# Altium schematic sheet BaseSheet.SchDoc: UnoCNC
size A3; PageSetup: Record=PageOptions|CenterHorizontal=True|CenterVertical=True|PrintScale=0.73|XCorrection=1.00|YCorrection=1.00|PrintKind=1|BorderSize=5000000|LeftOffset=0|BottomOffset=0|Orientation=2|PaperLength=1000|PaperWidth=1000|Scale=100|PaperSource=7|PrintQuality=-3|MediaType=1|DitherType=10|PrintScaleMode=1|PaperKind=A4|PaperIndex=9
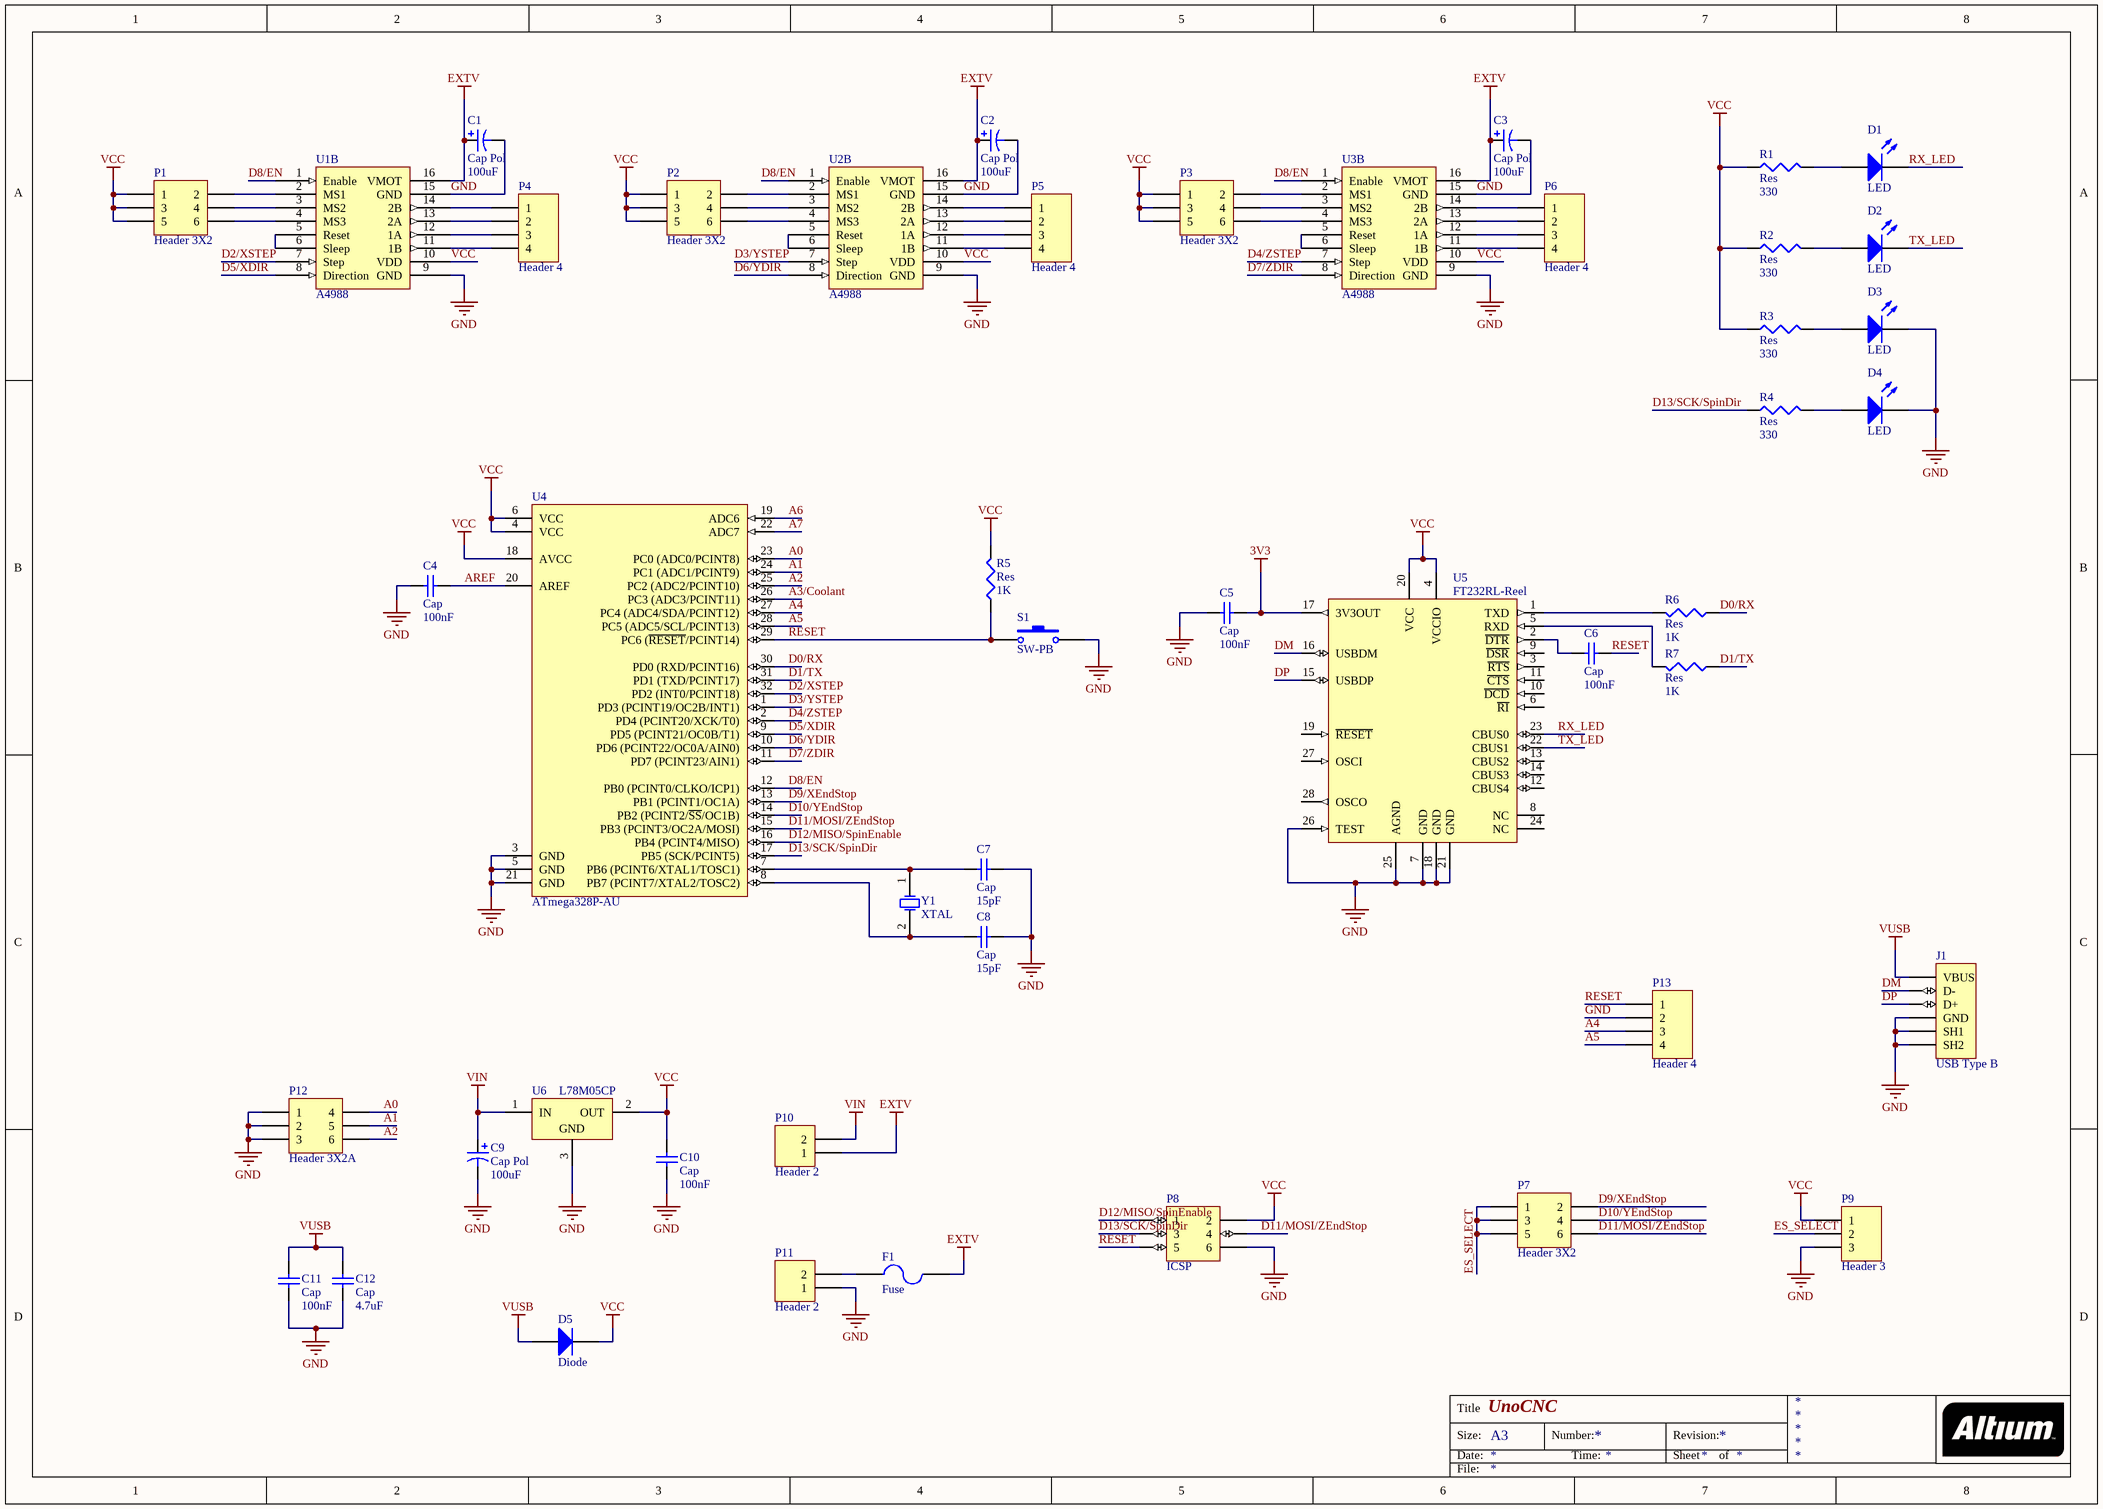
[diagram p0: BaseSheet.SchDoc]

## Parts
C1  Cap Pol  value 100uF  [CAPPR2.5-6.3x6.8/H.9]
C2  Cap Pol  value 100uF  [CAPPR2.5-6.3x6.8/H.9]
C3  Cap Pol  value 100uF  [CAPPR2.5-6.3x6.8/H.9]
C4  Cap  value 100nF  [C1206]
C5  Cap  value 100nF  [C1206]
C6  Cap  value 100nF  [C1206]
C7  Cap  value 15pF  [C1206]
C8  Cap  value 15pF  [C1206]
C9  Cap Pol  value 100uF  [CAPPR2.5-6.3x6.8/H.9]
C10  Cap  value 100nF  [C1206]
C11  Cap  value 100nF  [C1206]
C12  Cap  value 4.7uF  [C1206]
D1  LED  [6-0805_L]
D2  LED  [6-0805_L]
D3  LED  [6-0805_L]
D4  LED  [6-0805_L]
D5  Diode  [DSO-C2/X2.3]
F1  Fuse  [BLX-A]
J1  USB Type B  [USB2.5-2H4D]
P1  Header 3X2  [HDR2X3]
P2  Header 3X2  [HDR2X3]
P3  Header 3X2  [HDR2X3]
P4  Header 4  [HDR1X4]
P5  Header 4  [HDR1X4]
P6  Header 4  [HDR1X4]
P7  Header 3X2  [HDR2X3]
P8  ICSP  [HDR2X3]
P9  Header 3  [HDR1X3]
P10  Header 2  [HDR1X2]
P11  Header 2  [2Pin Phoenix Contact]
P12  Header 3X2A  [HDR2X3_CEN]
P13  Header 4  [HDR1X4]
R1  Res  value 330  [J1-0603]
R2  Res  value 330  [J1-0603]
R3  Res  value 330  [J1-0603]
R4  Res  value 330  [J1-0603]
R5  Res  value 1K  [J1-0603]
R6  Res  value 1K  [J1-0603]
R7  Res  value 1K  [J1-0603]
S1  SW-PB  [SPST-2]
U1  A4988  [DIP16]  (part B of 2)
U2  A4988  [DIP16]  (part B of 2)
U3  A4988  [DIP16]  (part B of 2)
U4  ATmega328P-AU  [32A_N]
U5  FT232RL-Reel  [SSOP-28_N]
U6  L78M05CP  [ISOWATT220AB]
Y1  XTAL  [BCY-W2/E4.7]

## Nets
3V3: C5.2 U5.17(3V3OUT)
EXTV: C1.1 C2.1 C3.1 F1.2 P10.1 U1.16(VMOT) U2.16(VMOT) U3.16(VMOT)
GND: C1.2 C2.2 C3.2 C4.1 C5.1 C7.2 C8.2 C9.2 C10.1 C11.1 C12.1 D3.2(K) D4.2(K) J1.4(GND) J1.5(SH1) J1.6(SH2) P8.6 P9.3 P11.1 P12.1 P12.2 P12.3 P13.2 S1.2 U1.9(GND) U1.15(GND) U2.9(GND) U2.15(GND) U3.9(GND) U3.15(GND) U4.3(GND) U4.5(GND) U4.21(GND) U5.7(GND) U5.18(GND) U5.21(GND) U5.25(AGND) U5.26(TEST) U6.3(GND)
VCC: C10.2 D5.2(K) P1.1 P1.3 P1.5 P2.1 P2.3 P2.5 P3.1 P3.3 P3.5 P8.2 P9.1 R1.1 R2.1 R3.1 R5.2 U1.10(VDD) U2.10(VDD) U3.10(VDD) U4.4(VCC) U4.6(VCC) U4.18(AVCC) U5.4(VCCIO) U5.20(VCC) U6.2(OUT)
VIN: C9.1 P10.2 U6.1(IN)
VUSB: C11.2 C12.2 D5.1(A) J1.1(VBUS)
A0: P12.4 U4.23(PC0_(ADC0/PCINT8))
A1: P12.5 U4.24(PC1_(ADC1/PCINT9))
A2: P12.6 U4.25(PC2_(ADC2/PCINT10))
A3/Coolant: U4.26(PC3_(ADC3/PCINT11))
A4: P13.3 U4.27(PC4_(ADC4/SDA/PCINT12))
A5: P13.4 U4.28(PC5_(ADC5/SCL/PCINT13))
A6: U4.19(ADC6)
A7: U4.22(ADC7)
AREF: C4.2 U4.20(AREF)
D0/RX: R6.1 U4.30(PD0_(RXD/PCINT16))
D1/TX: R7.1 U4.31(PD1_(TXD/PCINT17))
D2/XSTEP: U1.7(Step) U4.32(PD2_(INT0/PCINT18))
D3/YSTEP: U2.7(Step) U4.1(PD3_(PCINT19/OC2B/INT1))
D4/ZSTEP: U3.7(Step) U4.2(PD4_(PCINT20/XCK/T0))
D5/XDIR: U1.8(Direction) U4.9(PD5_(PCINT21/OC0B/T1))
D6/YDIR: U2.8(Direction) U4.10(PD6_(PCINT22/OC0A/AIN0))
D7/ZDIR: U3.8(Direction) U4.11(PD7_(PCINT23/AIN1))
D8/EN: U1.1(Enable) U2.1(Enable) U3.1(Enable) U4.12(PB0_(PCINT0/CLKO/ICP1))
D9/XEndStop: P7.2 U4.13(PB1_(PCINT1/OC1A))
D10/YEndStop: P7.4 U4.14(PB2_(PCINT2/~{SS}/OC1B))
D11/MOSI/ZEndStop: P7.6 P8.4 U4.15(PB3_(PCINT3/OC2A/MOSI))
D12/MISO/SpinEnable: P8.1 U4.16(PB4_(PCINT4/MISO))
D13/SCK/SpinDir: P8.3 R4.1 U4.17(PB5_(SCK/PCINT5))
DM: J1.2(D-) U5.16(USBDM)
DP: J1.3(D+) U5.15(USBDP)
ES_SELECT: P7.1 P7.3 P7.5 P9.2
RESET: C6.2 P8.5 P13.1 R5.1 S1.1 U4.29(PC6_(~{RESET}/PCINT14))
RX_LED: D1.2(K) U5.23(CBUS0)
TX_LED: D2.2(K) U5.22(CBUS1)
NetC6_1: C6.1 U5.2(~{DTR})
NetC7_1: C7.1 U4.7(PB6_(PCINT6/XTAL1/TOSC1)) Y1.1(OSC1)
NetC8_1: C8.1 U4.8(PB7_(PCINT7/XTAL2/TOSC2)) Y1.2(OSC2)
NetD1_1: D1.1(A) R1.2
NetD2_1: D2.1(A) R2.2
NetD3_1: D3.1(A) R3.2
NetD4_1: D4.1(A) R4.2
NetF1_1: F1.1 P11.2
NetP1_2: P1.2 U1.2(MS1)
NetP1_4: P1.4 U1.3(MS2)
NetP1_6: P1.6 U1.4(MS3)
NetP2_2: P2.2 U2.2(MS1)
NetP2_4: P2.4 U2.3(MS2)
NetP2_6: P2.6 U2.4(MS3)
NetP3_2: P3.2 U3.2(MS1)
NetP3_4: P3.4 U3.3(MS2)
NetP3_6: P3.6 U3.4(MS3)
NetP4_1: P4.1 U1.14(2B)
NetP4_2: P4.2 U1.13(2A)
NetP4_3: P4.3 U1.12(1A)
NetP4_4: P4.4 U1.11(1B)
NetP5_1: P5.1 U2.14(2B)
NetP5_2: P5.2 U2.13(2A)
NetP5_3: P5.3 U2.12(1A)
NetP5_4: P5.4 U2.11(1B)
NetP6_1: P6.1 U3.14(2B)
NetP6_2: P6.2 U3.13(2A)
NetP6_3: P6.3 U3.12(1A)
NetP6_4: P6.4 U3.11(1B)
NetR6_2: R6.2 U5.1(TXD)
NetR7_2: R7.2 U5.5(RXD)
NetU1_5: U1.5(Reset) U1.6(Sleep)
NetU2_5: U2.5(Reset) U2.6(Sleep)
NetU3_5: U3.5(Reset) U3.6(Sleep)

Not connected (* = marked no-connect by the designer): U5 3(~{RTS}) 6(~{RI}) 8(NC) 9(~{DSR}) 10(~{DCD}) 11(~{CTS}) 12(CBUS4) 13(CBUS2) 14(CBUS3) 19(~{RESET}) 24(NC) 27(OSCI) 28(OSCO)

## Notes on the sheet
- Title
- Size:
- Date:
- A3
- Number:
- Time:
- Revision:
- Sheet
- of
- File:

## Library data of the parts
C1-C3 C9 = Cap Pol1: Polarized Capacitor (Radial); Published: 8-Jun-2000; LatestRevisionDate: 17-Jul-2002; LatestRevisionNote: Re-released for DXP Platform.; PackageReference: RB7.6-15; Publisher: Altium Limited; PackageDescription: Polarized Capacitor (Radial); 2 Leads
C4-C8 C10-C12 = Cap Semi: Capacitor (Semiconductor SIM Model); Published: 8-Jun-2000; LatestRevisionDate: 29-May-2009; LatestRevisionNote: IPC-7351 Footprint Added.; PackageReference: C1206; Publisher: Altium Limited; PackageDescription: Chip Capacitor
D1-D4 = LED3: Typical BLUE SiC LED; Published: 8-Jun-2000; LatestRevisionDate: 17-Dec-2003; LatestRevisionNote: PCB Footprint replaced.; DatasheetVersion: 16-Apr-2002; PackageVersion: 16-Apr-2002; PackageReference: 3.5X2.8X1.9; Publisher: Altium Limited; PackageDescription: SM LED; 2 C-Bend Leads; Body 3.5 x 2.8 x 1.9 mm, inc leads (LxWxH typ)
D5 = Diode: Default Diode; Published: 8-Jun-2000; LatestRevisionDate: 17-Jul-2002; LatestRevisionNote: Re-released for DXP Platform.; PackageVersion: Sep-1996; PackageReference: SMC; Publisher: Altium Limited; PackageDescription: DO-214-AB/SMC; 2 C-Bend Leads; Body 7.9 x 5.9 mm, inc. leads (LxW); Code_JEDEC: DO-214-AB
F1 = Fuse 2: Published: 8-Jun-2000; LatestRevisionDate: 17-Jul-2002; LatestRevisionNote: Re-released for DXP Platform.; PackageReference: PIN-W2/E2.8; Publisher: Altium Limited; PackageDescription: Thru-Hole; 2 Leads
J1 = Header 6: Header, 6-Pin; LatestRevisionDate: 17-Jul-2002; LatestRevisionNote: Re-released for DXP Platform.; Publisher: Altium Limited
P1-P3 P7 P8 = Header 3X2: Header, 3-Pin, Dual row; LatestRevisionDate: 17-Jul-2002; LatestRevisionNote: Re-released for DXP Platform.; Publisher: Altium Limited
P4-P6 P13 = Header 4: Header, 4-Pin; LatestRevisionDate: 17-Jul-2002; LatestRevisionNote: Re-released for DXP Platform.; Publisher: Altium Limited
P9 = Header 3: Header, 3-Pin; LatestRevisionDate: 17-Jul-2002; LatestRevisionNote: Re-released for DXP Platform.; Publisher: Altium Limited
P10 P11 = Header 2: Header, 2-Pin; LatestRevisionDate: 17-Jul-2002; LatestRevisionNote: Re-released for DXP Platform.; Publisher: Altium Limited
P12 = Header 3X2A: Header, 3-Pin, Dual row; LatestRevisionDate: 17-Jul-2002; LatestRevisionNote: Re-released for DXP Platform.; Publisher: Altium Limited
R1-R7 = Res3: Resistor; Published: 8-Jun-2000; LatestRevisionDate: 29-May-2009; LatestRevisionNote: IPC-7351 Footprint Added.; PackageReference: J1-0603; Publisher: Altium Limited; PackageDescription: Chip Resistor
S1 = SW-PB: Switch; Published: 24-Mar-1999; LatestRevisionDate: 17-Jul-2002; LatestRevisionNote: Re-released for DXP Platform.; PackageReference: SPST-2; Publisher: Altium Limited; PackageDescription: Switch; 2 Leads
U1-U3 = A4988: Stepper Motor Driver
U4 = ATmega328P-AU: 8-bit AVR Microcontroller, 32KB Flash, 1KB EEPROM, 2KB SRAM, 32-pin TQFP, Industrial Grade (-40°C to 85°C); Published: 1-Apr-2010; DatasheetVersion: revA, Jan-2010; PackageVersion: revB, Oct-2001; PackageReference: 32A; Publisher: Altium Limited; PackageDescription: 32-Lead, 7x7x1.0 mm Body, 0.8mm Lead Pitch, Thin Profile Plastic Quad Flat Package (TQFP); Supplier 1: Digi-Key; Supplier Part Number 1: ATMEGA328P-AU-ND; Supplier 2: Farnell; Supplier Part Number 2: 1715486; Supplier 3: Mouser; Supplier Part Number 3: 556-ATMEGA328P-AU; Code_JEDEC: MS-026-ABA; ComponentLink1Description: Manufacturer Link; ComponentLink1URL: http://www.atmel.com/products/avr/default.asp?; ComponentLink2Description: ATmega48A/48PA/88A/88PA/168A/168PA/328/328P Datasheet; ComponentLink2URL: http://www.atmel.com/dyn/resources/prod_documents/8271.pdf; ComponentLink3Description: ATmega48A/48PA/88A/88PA/168A/168PA/328/328P Summary; ComponentLink3URL: http://www.atmel.com/dyn/resources/prod_documents/8271S.pdf; ComponentLink4Description: Atmel.com Home; ComponentLink4URL: http://www.atmel.com
U5 = FT232RL-Reel: USB UART Asynchronous Serial Data Transfer Chip, 28-pin SSOP, Tape and Reel; Manufacturer: FTDI; DatasheetVersion: ver 2.10, Mar-2012; PackageVersion: Mar-12; PackageReference: SSOP-28; PackageDescription: 28-Pin Small Outline Package 0.65 mm Pitch; PartNumber: FT232RL-Reel; ComponentLink1Description: Manufacturer URL; ComponentLink1URL: http://www.ftdichip.com/; ComponentLink2Description: Datasheet; ComponentLink2URL: http://www.ftdichip.com/Support/Documents/DataSheets/ICs/DS_FT232R.pdf
U6 = L78M05CP: Positive Voltage Regulator; Note: Tab is connected to pin 3 (GND).; Published: 24-Aug-2001; LatestRevisionDate: 17-Jul-2002; LatestRevisionNote: Re-released for DXP Platform.; DatasheetVersion: Apr-1994; PackageVersion: Jul-1998; PackageReference: ISOWATT220AB; Publisher: Altium Limited; PackageDescription: TO, Thru-Hole, Vertical, Heatsink Mounted; 3 In-Line Leads; Pitch 2.54 mm; Pin sequence 1, 3, 2; ComponentLink1Description: Manufacturer Link; ComponentLink1URL: http://www.st.com/; ComponentLink2Description: Datasheet; ComponentLink2URL: http://www.st.com/stonline/products/literature/ds/2146/l78m05c.pdf
Y1 = XTAL: Crystal Oscillator; Published: 8-Jun-2000; LatestRevisionDate: 17-Jul-2002; LatestRevisionNote: Re-released for DXP Platform.; PackageReference: R38; Publisher: Altium Limited; PackageDescription: Crystal, Thru-Hole; 2 Leads; Body 3.1 x 8.2 mm (Dia.xH)